# EAGLE design HIDdoorUnlocker (EAGLE 6.3)
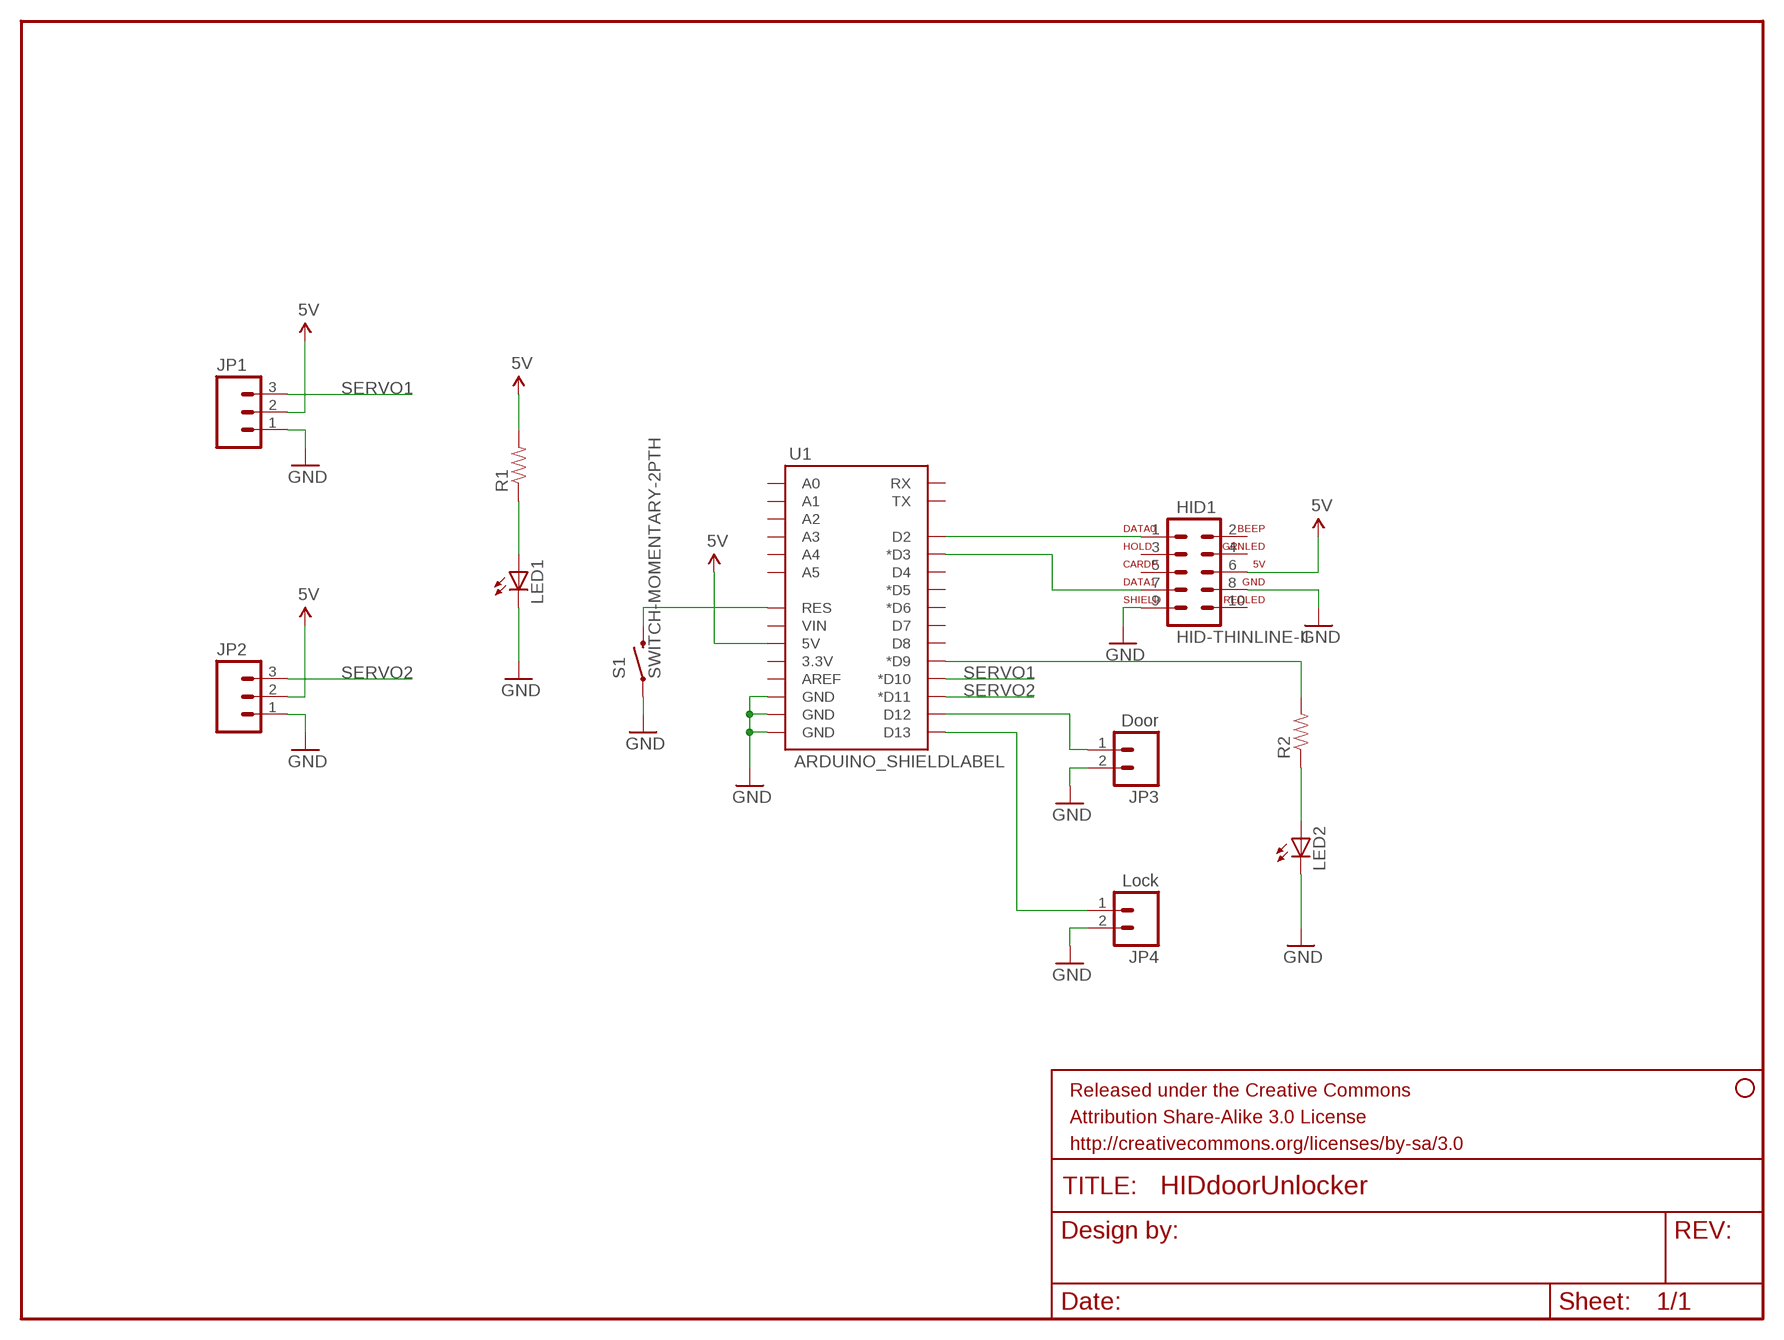
[diagram p0: schematic, sheet 1]

## Parts
FRAME1  FRAME-LETTER  [CREATIVE_COMMONS]
HID1  HID-THINLINE-II  [HID-2X5]
JP1  M03PTH  [1X03]
JP2  M03PTH  [1X03]
JP3  Door  M02PTH  [1X02]
JP4  Lock  M02PTH  [1X02]
LED1  LED5MM  [LED5MM]
LED2  LED5MM  [LED5MM]
R1  RESISTORPTH-1/4W  [AXIAL-0.4]
R2  RESISTORPTH-1/4W  [AXIAL-0.4]
S1  SWITCH-MOMENTARY-2PTH  [TACTILE-PTH]
STANDOFF1  STAND-OFF  [STAND-OFF]
U1  ARDUINO_SHIELDLABEL  [DUEMILANOVE_SHIELD]

## Nets
5V [power]: HID1.6 JP1.2 JP2.2 R1.P$2 U1.5V
GND [power]: HID1.8 HID1.9 JP1.1 JP2.1 JP3.2 JP4.2 LED1.K(C) LED2.K(C) S1.1 U1.GND@0(GND) U1.GND@1(GND) U1.GND@2(GND)
N$1: LED1.A R1.P$1
N$2: S1.3 U1.RES
N$3: HID1.1 U1.D2
N$4: HID1.7 U1.D3(*D3)
N$5: LED2.A R2.P$1
N$6: R2.P$2 U1.D9(*D9)
N$7: JP3.1 U1.D12
N$8: JP4.1 U1.D13
SERVO1: JP1.3 U1.D10(*D10)
SERVO2: JP2.3 U1.D11(*D11)
Unconnected: HID1.2 HID1.3 HID1.4 HID1.5 HID1.10 U1.3.3V U1.A0 U1.A1 U1.A2 U1.A3 U1.A4 U1.A5 U1.AREF U1.D4 U1.D5(*D5) U1.D6(*D6) U1.D7 U1.D8 U1.RX U1.TX U1.VIN

## Library data of the parts
FRAME1 = SparkFun-Aesthetics:FRAME-LETTER: Schematic Frame Standard 8.5x11 US Letter frame
HID1 = GT-MAKE-RFID:HID-THINLINE-II
JP1 JP2 = SparkFun-Connectors:M03: Header 3 Standard 3-pin 0.1" header. Use with straight break away headers (SKU : PRT-00116), right angle break away headers (PRT-00553), swiss pins (PRT-00743), machine pins (PRT-00117), and female headers (PRT-00115). Molex polarized connector foot print use with SKU : PRT-08232 with associated crimp pins and housings.
JP3 JP4 = SparkFun-Connectors:M02: Header 2 Standard 2-pin 0.1" header. Use with straight break away headers (SKU : PRT-00116), right angle break away headers (PRT-00553), swiss pins (PRT-00743), machine pins (PRT-00117), and female headers (PRT-00115). Molex polarized connector foot print use with SKU : PRT-08233 with associated crimp pins and housings.
LED1 LED2 = SparkFun-LED:LED: LEDs Standard schematic elements and footprints for 5mm, 3mm, 1206, and 0603 sized LEDs. 5mm - Spark Fun Electronics SKU : COM-00529 (and others)
R1 R2 = SparkFun-Passives:RESISTOR: Resistor Basic schematic elements and footprints for 0603, 1206, and PTH resistors.
S1 = SparkFun-Electromechanical:SWITCH-MOMENTARY-2: Various NO switches- pushbuttons, reed, etc
STANDOFF1 = SparkFun-Electromechanical:STAND-OFF: #4 Stand Off This is the mechanical footprint for a #4 phillips button head screw. Use the keepout ring to avoid running the screw head into surrounding components. SKU : PRT-00447
U1 = SparkFun-Boards:ARDUINO_SHIELD: Arduino shield footprint

## Net classes
0 default: width 0.406 mm
1 power: width 0.61 mm

## Board
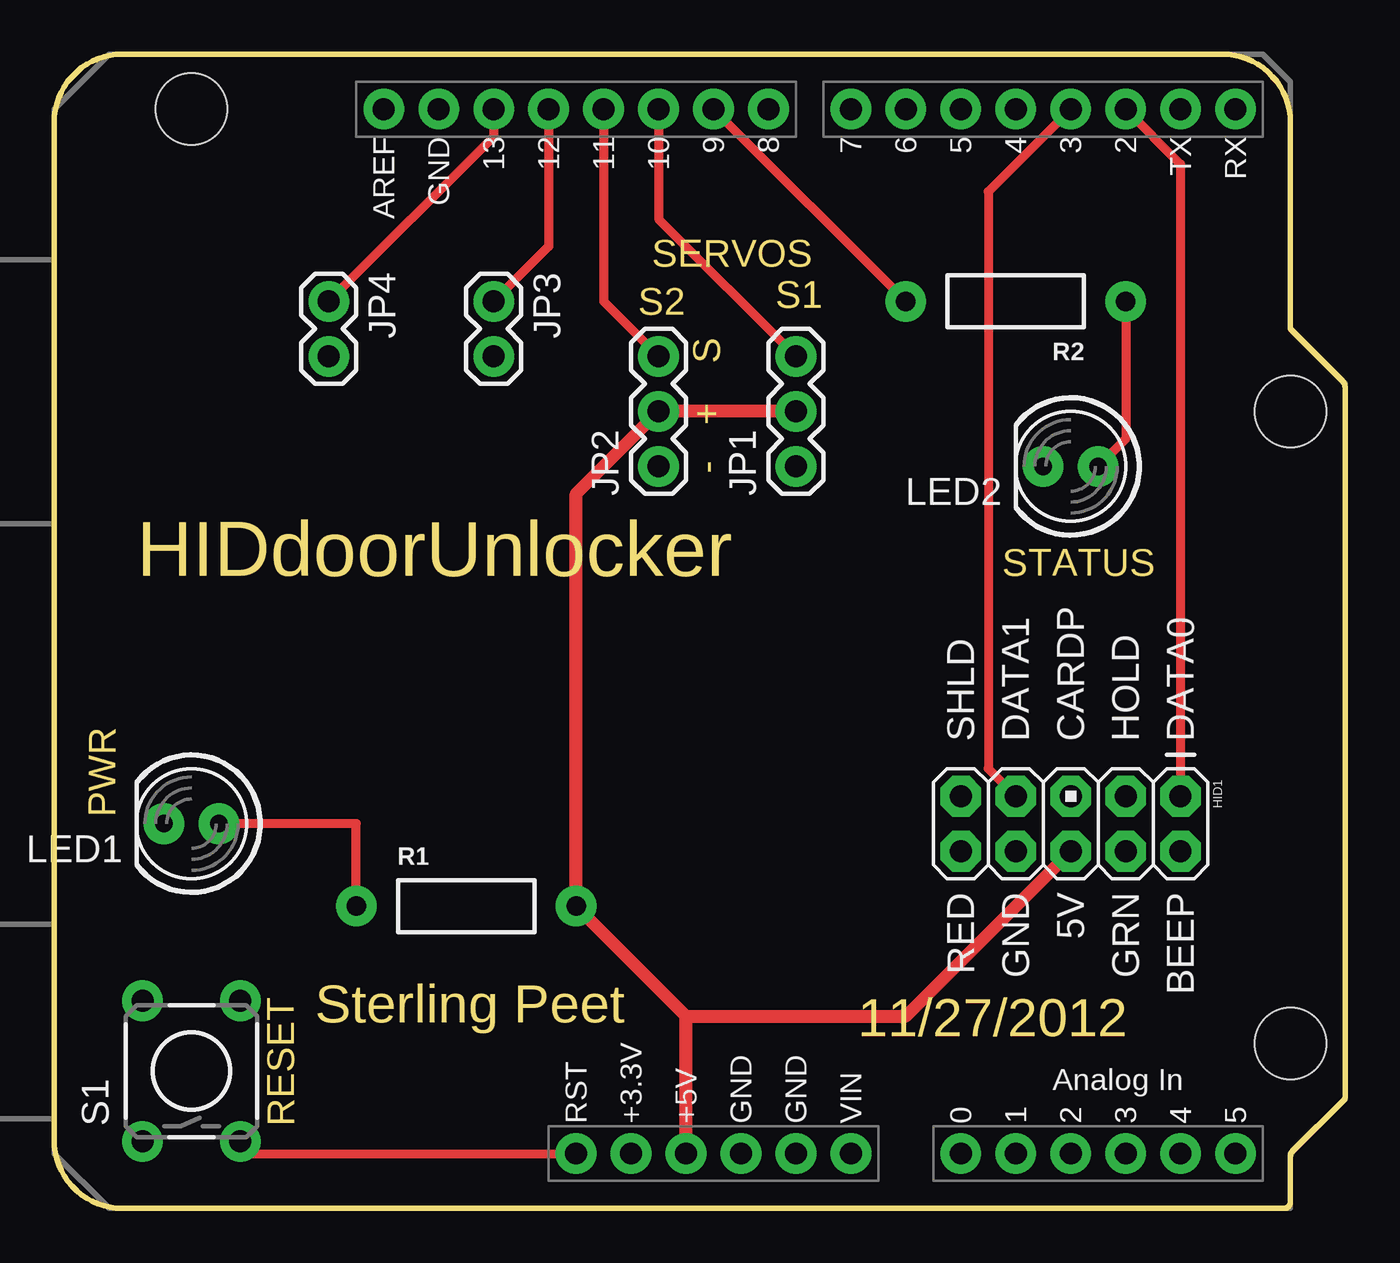
[diagram p1: board, top side]
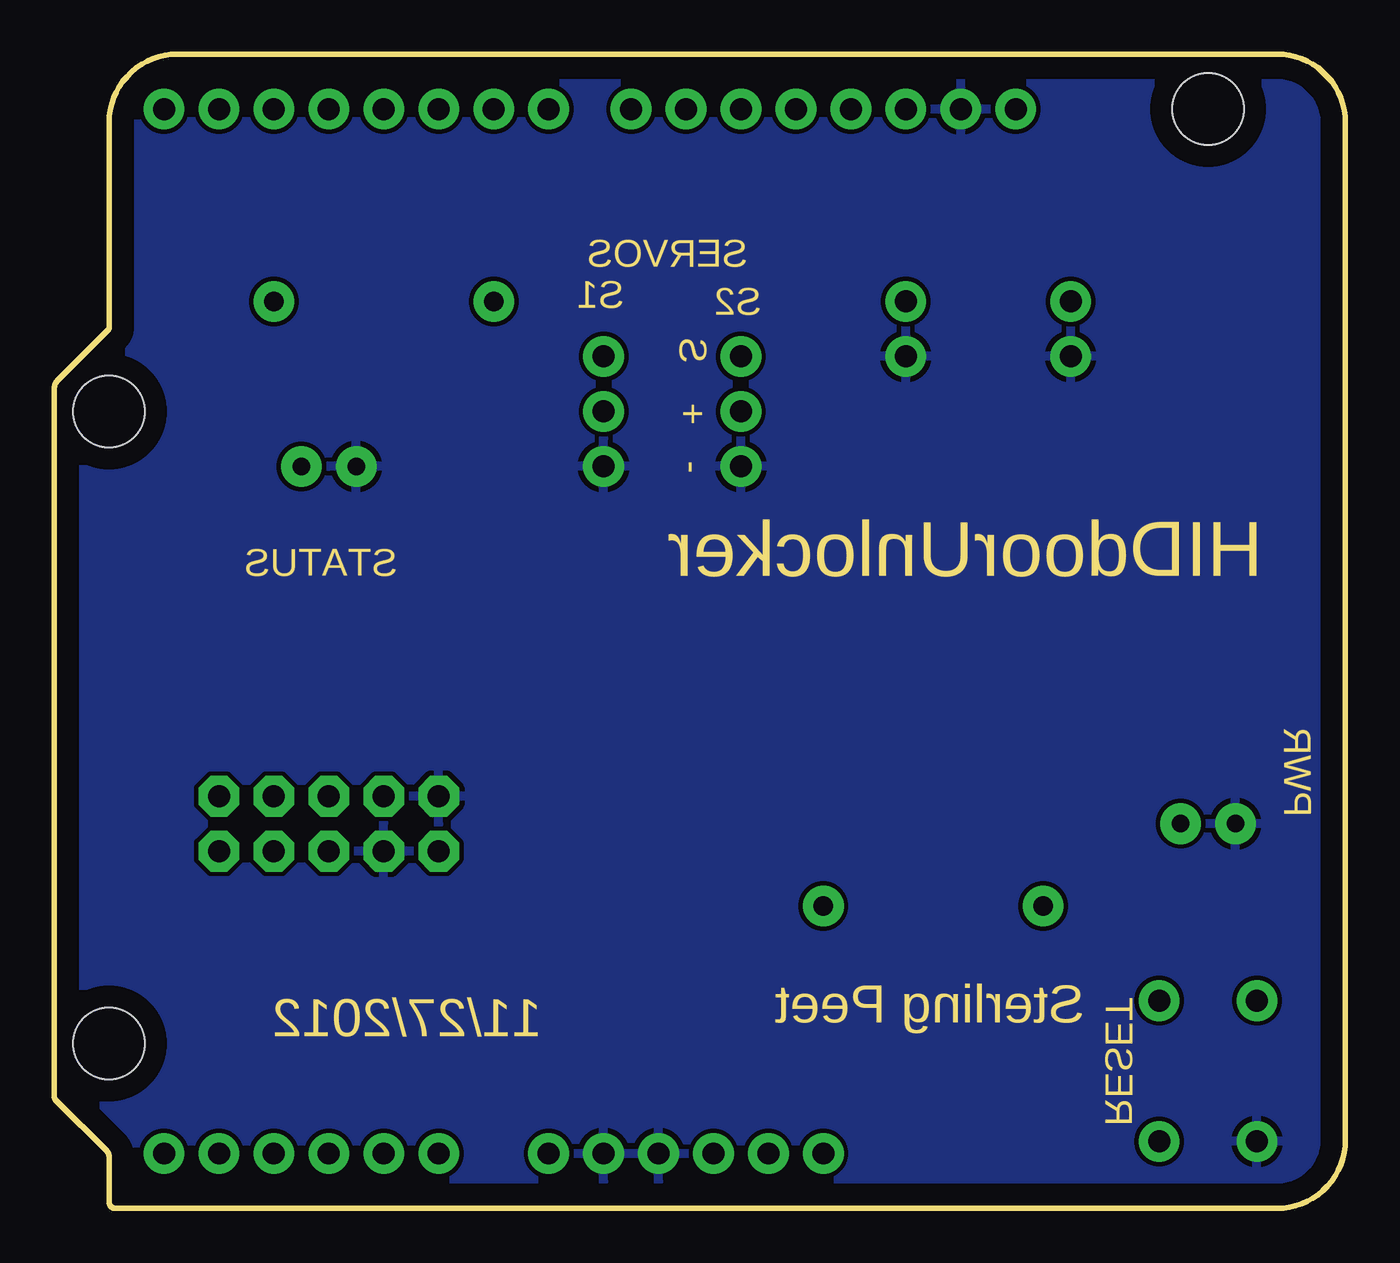
[diagram p2: board, bottom side, seen from below]

Size 59.69 x 53.34 mm. Coordinates in mm from the lower left corner, seen from the top.
Outline: 3.17,53.34 53.98,53.34 arc-90 57.15,50.16 57.15,40.69 arc45 57.19,40.6 59.5,38.29 arc-45 59.69,37.84 59.69,5.21 arc-45 59.6,4.99 57.24,2.63 arc45 57.15,2.41 57.15,0.32 arc-90 56.83,0 3.17,0 arc-90 0,3.17 0,50.16 arc-90 3.17,53.34
Copper layers (1*16): Top 0.035mm / dielectric 1.5mm / Bottom 0.035mm
Design rules "default": minimum track width 10mil, minimum drill 24mil, track to track 8mil, track to pad 8mil, pad to pad 8mil, via to via 8mil, smd to smd 8mil, copper to edge 40mil, drill to drill 8mil, minimum pad ring 10mil, minimum via ring 8mil, stop-mask expansion 4mil, vias tented up to drill 0mil, thermal gap 10mil

### Footprints (pad centres in the part's own frame; a part is rotated, then mirrored left to right if it is on the bottom)
HID-2X5 = drill 1.016 pad 1.88 octagon: 1 -1.27,5.08; 2 1.27,5.08; 3 -1.27,2.54; 4 1.27,2.54; 5 -1.27,0; 6 1.27,0; 7 -1.27,-2.54; 8 1.27,-2.54; 9 -1.27,-5.08; 10 1.27,-5.08
1X03 = drill 1.016 pad 1.88: 1 0,0; 2 2.54,0; 3 5.08,0
1X02 = drill 1.016 pad 1.88: 1 0,0; 2 2.54,0
LED5MM = drill 0.813 pad 1.88: A -1.27,0; K 1.27,0
AXIAL-0.4 = drill 0.9 pad 1.88: P$1 -5.08,0; P$2 5.08,0
TACTILE-PTH = drill 1.016 pad 1.88: 1 -3.251,2.261; 2 3.251,2.261; 3 -3.251,-2.261; 4 3.251,-2.261
STAND-OFF = hole 3.302: 0,0
DUEMILANOVE_SHIELD = drill 1.016 pad 1.88: 3.3V 50.8,26.67; 5V 50.8,29.21; A0 50.8,41.91; A1 50.8,44.45; A2 50.8,46.99; A3 50.8,49.53; A4 50.8,52.07; A5 50.8,54.61; AREF 2.54,15.24; D2 2.54,49.53; D3 2.54,46.99; D4 2.54,44.45; D5 2.54,41.91; D6 2.54,39.37; D7 2.54,36.83; D8 2.54,33.02; D9 2.54,30.48; D10 2.54,27.94; D11 2.54,25.4; D12 2.54,22.86; D13 2.54,20.32; GND@0 50.8,31.75; GND@1 50.8,34.29; GND@2 2.54,17.78; RES 50.8,24.13; RX 2.54,54.61; TX 2.54,52.07; VIN 50.8,36.83 | hole 3.302: 45.72,57.15; 2.54,6.35

### Placement (x,y rotation side)
FRAME1  13.97,58.42 0 top  (outside the outline)
HID1  46.99,17.78 270 top
JP1  34.29,34.29 90 top
JP2  27.94,34.29 90 top
JP3  20.32,41.91 270 top
JP4  12.7,41.91 270 top
LED1  6.35,17.78 180 top
LED2  46.99,34.29 180 top
R1  19.05,13.97 0 top
R2  44.45,41.91 180 top
S1  6.35,6.35 90 top
STANDOFF1  57.15,36.83 0 top
U1  0,53.34 270 top

### Tracks (layer width: path | path; a pad name or v marks a point on that pad's centre or on a via)
5V
  Top 0.61: JP1.2 JP2.2 24.13,33.02 R1.P$2 29.21,8.89 | U1.5V 29.21,8.89 | HID1.6 39.37,8.89 29.21,8.89
GND
  pour Bottom: 0,0 62.23,0 62.23,55.88 0,55.88
N$1
  Top 0.406: LED1.A 13.97,17.78 R1.P$1
N$2
  Top 0.406: U1.RES 8.89,2.54 S1.3
N$3
  Top 0.406: HID1.1 52.07,48.26 U1.D2
N$4
  Top 0.406: HID1.7 43.18,20.32 43.18,46.99 U1.D3
N$5
  Top 0.406: LED2.A 49.53,35.56 R2.P$1
N$6
  Top 0.406: U1.D9 R2.P$2
N$7
  Top 0.406: JP3.1 22.86,44.45 U1.D12
N$8
  Top 0.406: JP4.1 20.32,49.53 U1.D13
SERVO1
  Top 0.406: JP1.3 27.94,45.72 U1.D10
SERVO2
  Top 0.406: JP2.3 25.4,41.91 U1.D11

### Text on the board
Dimension: SERVOS | S1 | S2 | S | + | - | HIDdoorUnlocker | STATUS | PWR | Sterling Peet | 11/27/2012 | RESET